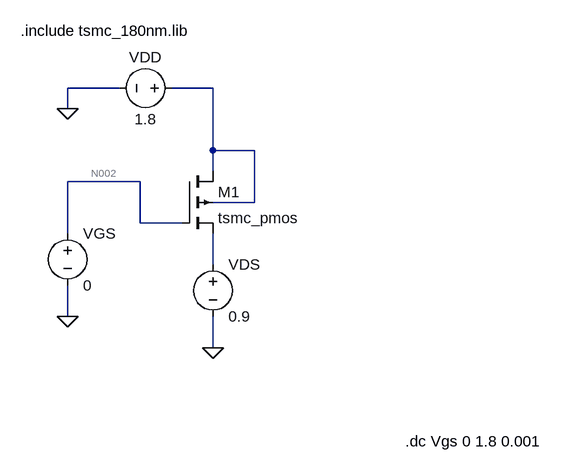
[diagram p0: schematic gm_pmos.asc]
gm_pmos.asc, the LTspice schematic file:
Version 4.1
SHEET 1 880 680
WIRE -64 -304 -144 -304
WIRE 80 -304 16 -304
WIRE -144 -272 -144 -304
WIRE 80 -208 80 -304
WIRE 144 -208 80 -208
WIRE 80 -176 80 -208
WIRE -32 -160 -144 -160
WIRE 144 -128 144 -208
WIRE 144 -128 80 -128
WIRE -32 -96 -32 -160
WIRE 32 -96 -32 -96
WIRE -144 -80 -144 -160
WIRE 80 -32 80 -80
WIRE -144 48 -144 0
WIRE 80 96 80 48
FLAG -144 48 0
FLAG 80 96 0
FLAG -144 -272 0
SYMBOL voltage -144 -96 R0
WINDOW 123 0 0 Left 0
WINDOW 39 0 0 Left 0
SYMATTR InstName VGS
SYMATTR Value 0
SYMBOL voltage 80 -48 R0
WINDOW 123 0 0 Left 0
WINDOW 39 0 0 Left 0
SYMATTR InstName VDS
SYMATTR Value 0.9
SYMBOL pmos4 32 -176 R0
SYMATTR InstName M1
SYMATTR Value tsmc_pmos
SYMATTR Value2 l=0.18u w=10u
SYMBOL voltage 32 -304 R90
WINDOW 0 -32 56 VBottom 2
WINDOW 3 32 56 VTop 2
SYMATTR InstName VDD
SYMATTR Value 1.8
TEXT -216 -392 Left 2 !.include tsmc_180nm.lib
TEXT 376 240 Left 2 !.dc Vgs 0 1.8 0.001

The netlist it stands for:
* gm_pmos.asc
VGS N002 0 0
VDS N003 0 0.9
M1 N001 N002 N003 N001 tsmc_pmos l=0.18u w=10u
VDD N001 0 1.8
.model NMOS NMOS
.model PMOS PMOS
.lib standard.mos
.include tsmc_180nm.lib
.dc Vgs 0 1.8 0.001
.backanno
.end

* Results of the author's LTspice run, read from the files saved beside the schematic
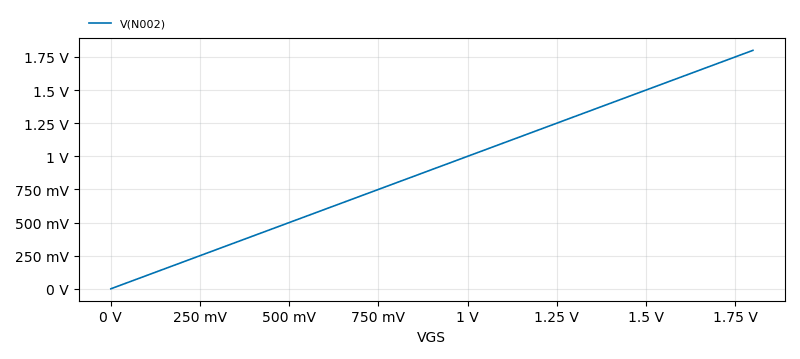
[diagram p1: DC transfer characteristic of gm_pmos.asc, plotted from the saved traces]
* DC transfer characteristic, 1 run:
*   V(N002): 0 V at VGS=0 V, 1.8 V at VGS=1.8 V, min 0 V, max 1.8 V